# EAGLE design tile (EAGLE 6.1)

## Sheet 1 of 2
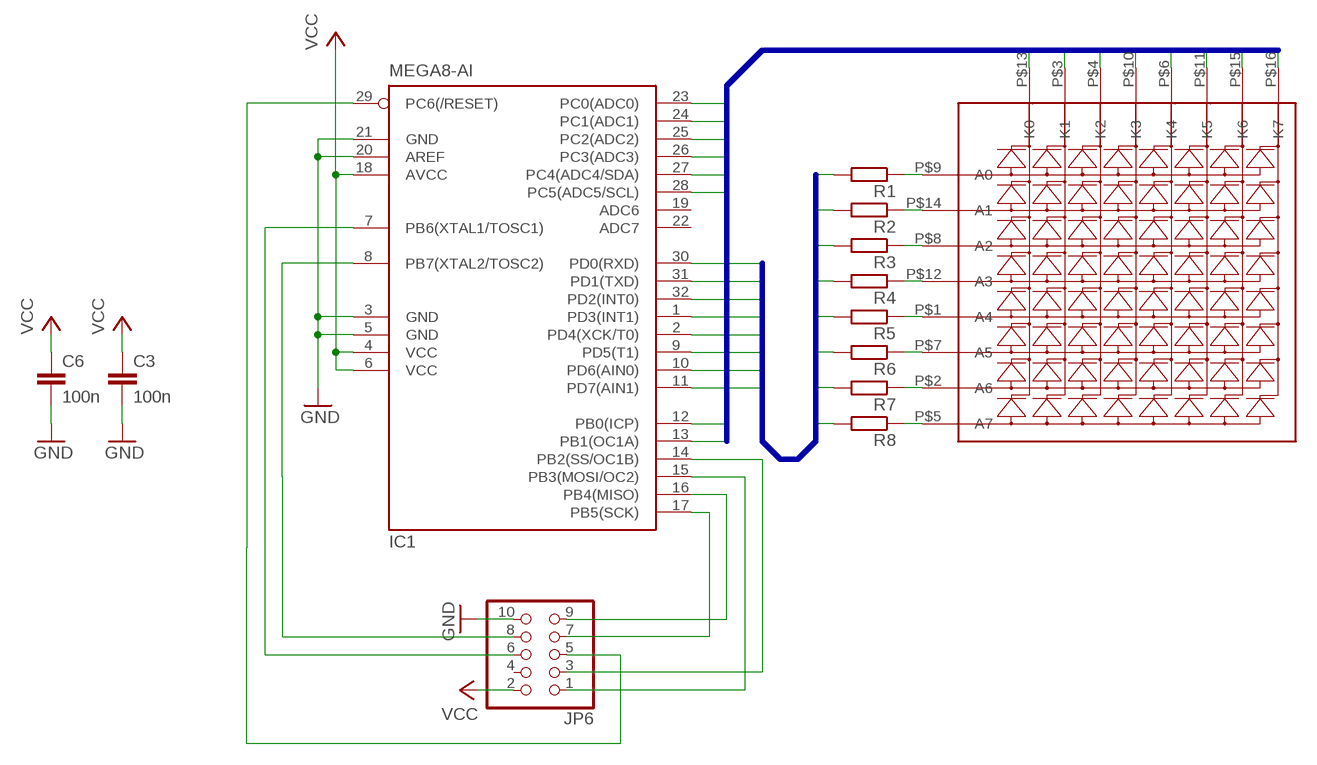
[diagram p0: schematic, sheet 1]

### Parts
C3  100n  C-EUC0805  [C0805]
C6  100n  C-EUC0805  [C0805]
IC1  MEGA8-AI  [TQFP32-08]
JP6  PINHD-2X5_2.54  [2X05]
R1  R-EU_M0805  [M0805]
R2  R-EU_M0805  [M0805]
R3  R-EU_M0805  [M0805]
R4  R-EU_M0805  [M0805]
R5  R-EU_M0805  [M0805]
R6  R-EU_M0805  [M0805]
R7  R-EU_M0805  [M0805]
R8  R-EU_M0805  [M0805]
U$1  LED-MATRIX  [LED-MATRIX]

### Nets
A0: IC1.30(PD0(RXD)) R1.1 R1.2 U$1.P$9(A0)
A1: IC1.31(PD1(TXD)) R2.1 R2.2 U$1.P$14(A1)
A2: IC1.32(PD2(INT0)) R3.1 R3.2 U$1.P$8(A2)
A3: IC1.1(PD3(INT1)) R4.1 R4.2 U$1.P$12(A3)
A4: IC1.2(PD4(XCK/T0)) R5.1 U$1.P$1(A4)
A5: IC1.9(PD5(T1)) R5.2 R6.1 R6.2 U$1.P$7(A5)
A6: IC1.10(PD6(AIN0)) R7.1 R7.2 U$1.P$2(A6)
A7: IC1.11(PD7(AIN1)) R8.1 R8.2 U$1.P$5(A7)
GND: C3.2 C6.2 IC1.3(GND) IC1.5(GND) IC1.20(AREF) IC1.21(GND) JP6.10 ; also sheet 2
K0: IC1.23(PC0(ADC0)) U$1.P$13(K0)
K1: IC1.24(PC1(ADC1)) U$1.P$3(K1)
K2: IC1.25(PC2(ADC2)) U$1.P$4(K2)
K3: IC1.26(PC3(ADC3)) U$1.P$10(K3)
K4: IC1.27(PC4(ADC4/SDA)) U$1.P$6(K4)
K5: IC1.28(PC5(ADC5/SCL)) U$1.P$11(K5)
K6: IC1.12(PB0(ICP)) U$1.P$15(K6)
K7: IC1.13(PB1(OC1A)) U$1.P$16(K7)
N$1: IC1.17(PB5(SCK)) JP6.7
N$4: IC1.8(PB7(XTAL2/TOSC2)) JP6.8
N$6: IC1.29(PC6(/RESET)) JP6.5
N$8: IC1.14(PB2(SS/OC1B)) JP6.3
N$19: IC1.16(PB4(MISO)) JP6.9
N$20: IC1.15(PB3(MOSI/OC2)) JP6.1
N$33: IC1.7(PB6(XTAL1/TOSC1)) JP6.6
VCC: C3.1 C6.1 IC1.4(VCC) IC1.6(VCC) IC1.18(AVCC) JP6.2 ; also sheet 2
Unconnected: IC1.19(ADC6) IC1.22(ADC7) JP6.4

### Buses
K[0..7]
A[0..7]

## Sheet 2 of 2
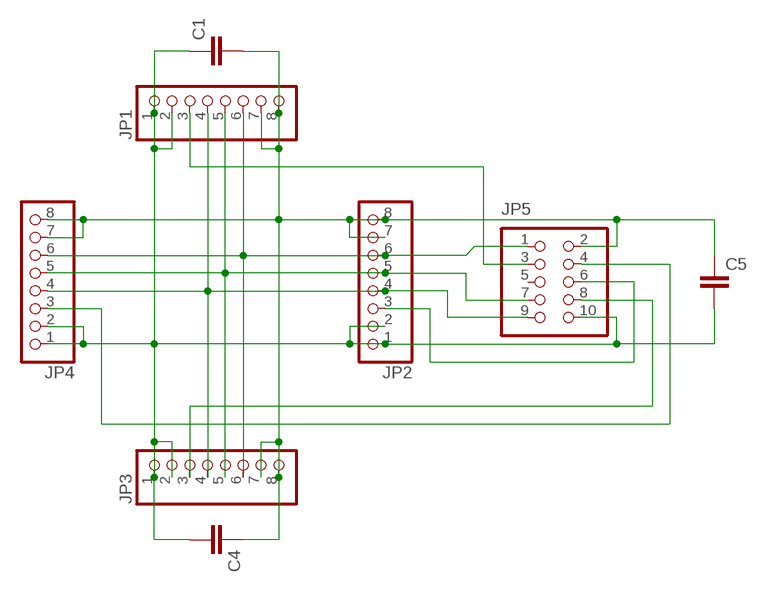
[diagram p1: schematic, sheet 2]

### Parts
C1  C-EUC0805  [C0805]
C4  C-EUC0805  [C0805]
C5  C-EUC0805  [C0805]
JP1  PINHD-1X8_2.00  [1X08M]
JP2  PINHD-1X8_2.00  [1X08M]
JP3  PINHD-1X8_2.00  [1X08M]
JP4  PINHD-1X8_2.00  [1X08M]
JP5  PINHD-2X5_2.54  [2X05]

### Nets
GND: C1.1 C4.2 C5.2 JP1.1 JP1.2 JP2.1 JP2.2 JP3.1 JP3.2 JP4.1 JP4.2 JP5.10 ; also sheet 1
N$2: JP4.3 JP5.4
N$3: JP3.3 JP5.8
N$7: JP2.3 JP5.6
N$9: JP1.3 JP5.3
N$21: JP1.6 JP2.6 JP3.6 JP4.6 JP5.1
N$22: JP1.5 JP2.5 JP3.5 JP4.5 JP5.7
N$23: JP1.4 JP2.4 JP3.4 JP4.4 JP5.9
VCC: C1.2 C4.1 C5.1 JP1.7 JP1.8 JP2.7 JP2.8 JP3.7 JP3.8 JP4.7 JP4.8 JP5.2 ; also sheet 1
Unconnected: JP5.5

## Library data of the parts
C1 C3-C6 = rcl:C-EU: CAPACITOR, European symbol
IC1 = atmel:MEGA8: MICROCONTROLLER 8 Kbytes FLASH, 1 kbytes SRAM, 512 bytes EEPROM, USART, 6-channel 10 bit ADC, 2-channel 8 bit ADC Pin compatible with Atmega48, ATMega88, ATMega168 Source: avr.lbr
JP1-JP4 = pinhead:PINHD-1X8: PIN HEADER
JP5 JP6 = pinhead:PINHD-2X5: PIN HEADER
R1-R8 = rcl:R-EU_: RESISTOR, European symbol
U$1 = led-matrix:LED-MATRIX

## Board
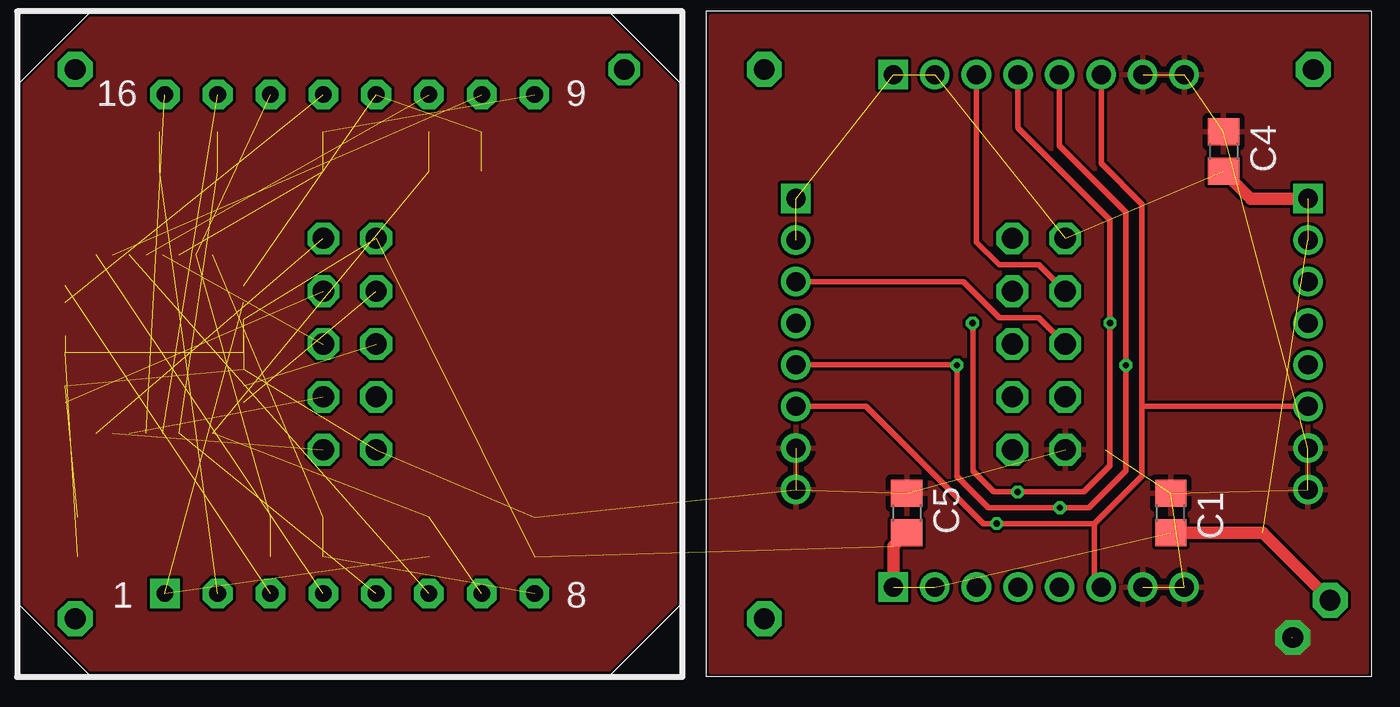
[diagram p2: board, top side]
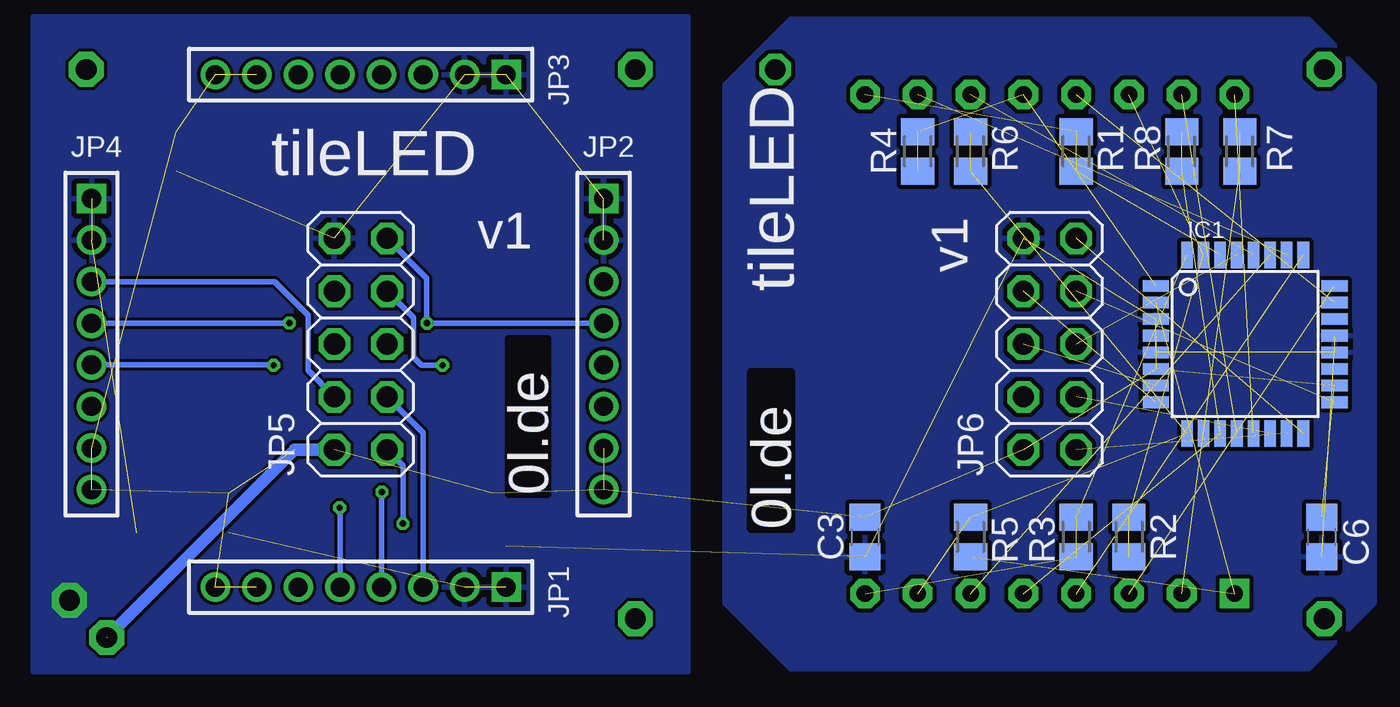
[diagram p3: board, bottom side, seen from below]

No outline drawn. Coordinates in mm, seen from the top.
Copper layers (1*16): Top 0.035mm / dielectric 1.5mm / Bottom 0.035mm
Design rules: minimum track width 6mil, minimum drill 12mil, track to track 6mil, track to pad 6mil, pad to pad 6mil, via to via 6mil, smd to smd 0mil, copper to edge 10mil, drill to drill 10mil, minimum pad ring 10mil, minimum via ring 6mil, stop-mask expansion 2mil, vias tented up to drill 100mil, thermal gap 10mil

### Footprints (pad centres in the part's own frame; a part is rotated, then mirrored left to right if it is on the bottom)
C0805 = smd 1.3 x 1.5: 1 -0.95,0; 2 0.95,0
TQFP32-08 = smd 1.27 x 0.559: 1 -4.293,2.8; 2 -4.293,2; 3 -4.293,1.2; 4 -4.293,0.4; 5 -4.293,-0.4; 6 -4.293,-1.2; 7 -4.293,-2; 8 -4.293,-2.8; 17 4.293,-2.8; 18 4.293,-2; 19 4.293,-1.2; 20 4.293,-0.4; 21 4.293,0.4; 22 4.293,1.2; 23 4.293,2; 24 4.293,2.8 | smd 0.559 x 1.27: 9 -2.8,-4.293; 10 -2,-4.293; 11 -1.2,-4.293; 12 -0.4,-4.293; 13 0.4,-4.293; 14 1.2,-4.293; 15 2,-4.293; 16 2.8,-4.293; 25 2.8,4.293; 26 2,4.293; 27 1.2,4.293; 28 0.4,4.293; 29 -0.4,4.293; 30 -1.2,4.293; 31 -2,4.293; 32 -2.8,4.293
1X08M = drill 0.914 square: 1 -7,0 | drill 0.914: 2 -5,0; 3 -3,0; 4 -1,0; 5 1,0; 6 3,0; 7 5,0; 8 7,0
2X05 = drill 1.016 octagon: 1 -5.08,-1.27; 2 -5.08,1.27; 3 -2.54,-1.27; 4 -2.54,1.27; 5 0,-1.27; 6 0,1.27; 7 2.54,-1.27; 8 2.54,1.27; 9 5.08,-1.27; 10 5.08,1.27
M0805 = smd 1.3 x 1.6: 1 -0.95,0; 2 0.95,0
LED-MATRIX = drill 0.8 pad 1.422 square: P$1 7.11,4 | drill 0.8 pad 1.422 octagon: P$2 9.65,4; P$3 12.19,4; P$4 14.73,4; P$5 17.27,4; P$6 19.81,4; P$7 22.35,4; P$8 24.89,4; P$9 24.89,28; P$10 22.35,28; P$11 19.81,28; P$12 17.27,28; P$13 14.73,28; P$14 12.19,28; P$15 9.65,28; P$16 7.11,28

### Placement (x,y rotation side)
C1  55.5,7.87 90 top
C3  24.89,6.73 270 bottom
C4  58.04,25.27 270 top
C5  42.8,7.87 270 top
C6  2.92,6.73 270 bottom
IC1  6.6,16 0 bottom
JP1  49.15,4.32 180 bottom
JP2  37.47,16 270 bottom
JP3  49.15,28.96 180 bottom
JP4  62.1,16 270 bottom
JP5  49.15,16 90 bottom
JP6  16,16 90 bottom
R1  14.73,25.27 270 bottom
R2  12.19,6.73 90 bottom
R3  14.73,6.73 90 bottom
R4  22.35,25.27 270 bottom
R5  19.81,6.73 90 bottom
R6  19.81,25.27 270 bottom
R7  6.86,25.27 270 bottom
R8  9.65,25.27 270 bottom
U$1  0,0 0 top

### Tracks (layer width: path | path; a pad name or v marks a point on that pad's centre or on a via)
A0  (3 unrouted)
A1  (3 unrouted)
A2  (3 unrouted)
A3  (3 unrouted)
A4  (2 unrouted)
A5  (4 unrouted)
A6  (3 unrouted)
A7  (3 unrouted)
GND  (via drill 1 pad 1.68)  (16 unrouted)
  Top 0.61: C1.1 59.93,6.92 v63.16,3.69 | JP4.1 59.36,23 C4.2 | JP1.1 42.15,6.27 C5.2
  Bottom 0.406: v63.16,3.69 63.12,3.69 63.12,3.68
  pour Bottom (isolate 0.203): 0.38,28.45 3.56,31.62 28.45,31.62 31.62,28.45 31.62,3.56 28.45,0.38 3.56,0.38 0.38,3.56
  pour Bottom: 64.9,0.25 33.4,0.25 33.4,31.75 64.9,31.75
K0  (1 unrouted)
K1  (1 unrouted)
K2  (1 unrouted)
K3  (1 unrouted)
K4  (1 unrouted)
K5  (1 unrouted)
K6  (1 unrouted)
K7  (1 unrouted)
N$1  (1 unrouted)
N$2
  Bottom 0.254: JP4.3 53.29,19 51.69,17.4 51.69,14.73 JP5.4
N$3
  Top 0.254: JP3.3 46.15,24.51 46.15,20.91 47.24,19.81 49.15,19.81 JP5.8
N$4  (1 unrouted)
N$6  (1 unrouted)
N$7
  Top 0.254: JP2.3 45.51,19 47.24,17.27 49.15,17.27 JP5.6
N$8  (1 unrouted)
N$9
  Bottom 0.254: JP1.3 46.15,11.73 JP5.3
N$10
  pour Top: 0.38,28.45 3.56,31.62 28.45,31.62 31.62,28.45 31.62,3.56 28.45,0.38 3.56,0.38 0.38,3.56
N$17  (via drill 1 pad 1.68)
  other vias: 2.79,29.21
N$18  (via drill 1)
  other vias: 29.21,29.21
N$19  (1 unrouted)
N$20  (1 unrouted)
N$21  (via drill 0.3)
  Top 0.254: 44.45,9.4 46.48,7.37 | 46.48,7.37 v47.12,7.37 | v47.12,7.37 51.82,7.37 | 51.82,7.37 54.1,9.65 54.1,12.95 | JP3.6 52.15,24.69 54.1,22.73 54.1,12.95 | 51.82,7.37 51.82,4.65 JP1.6 | 44.45,9.4 46.48,7.37 | 46.48,7.37 v47.12,7.37 | 44.45,9.4 40.85,13 JP2.6 | JP4.6 54.15,13 54.1,12.95
  Bottom 0.254: v47.12,7.37 47.12,10.16 JP5.1
N$22  (via drill 0.3)
  Top 0.254: JP2.5 45.2,15 v45.21,14.99 45.21,9.65 46.74,8.13 49.66,8.13 v50.16,8.13 51.56,8.13 53.34,9.91 v53.34,14.99 53.34,15.49 53.34,22.35 51.69,24 50.15,25.54 JP3.5
  Bottom 0.254: JP1.5 50.15,8.11 v50.16,8.13 | JP4.5 53.36,15 v53.34,14.99 | v45.21,14.99 46.23,14.99 46.61,15.37 46.61,17.27 JP5.7
N$23  (via drill 0.3)
  Top 0.254: v45.96,17 v45.97,17.02 45.97,9.91 46.99,8.89 v48.13,8.89 51.31,8.89 52.58,10.16 v52.58,17.02 52.58,21.97 48.15,26.4 JP3.4
  Bottom 0.254: JP2.4 v45.96,17 | JP4.4 52.59,17 v52.58,17.02 | v45.97,17.02 45.97,19.18 JP5.9 | v48.13,8.89 48.13,4.33 JP1.4
N$27  (via drill 1 pad 1.68)
  other vias: 2.79,2.79
N$29  (via drill 1 pad 1.68)
  other vias: 35.94,2.79
N$31  (via drill 1 pad 1.68)
  other vias: 35.94,29.21
N$32  (via drill 1 pad 1.68)
  other vias: 62.36,29.21
N$33  (1 unrouted)
VCC  (via drill 0.99 pad 1.68)  (18 unrouted)
  Top 0.406: v61.37,1.89 61.36,1.89
  Bottom 0.61: JP5.2 52.32,10.92 61.34,1.91
  pour Top: 64.9,0.25 33.4,0.25 33.4,31.75 64.9,31.75

### Text on the board
Bottom: 0l.de | 0l.de
bPlace: tileLED | tileLED | v1 | v1 | 0l.de | 0l.de